# EAGLE design PlacaSchematicbck2 (EAGLE 5.11)
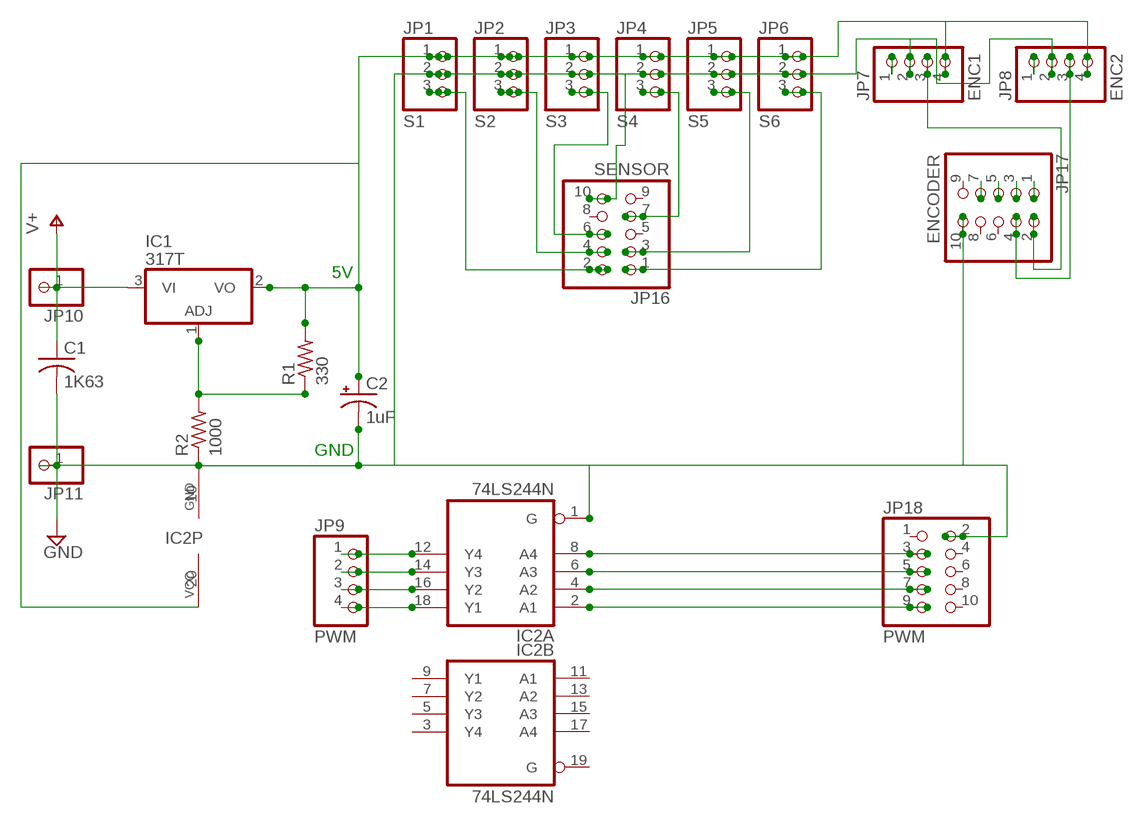
[diagram p0: schematic, sheet 1]

## Parts
C1  1K63  C-US050-025X075  [C050-025X075]
C2  1uF  CPOL-USE2-5  [E2-5]
IC1  317T  [TO220H]
IC2  74LS244N  [DIL20]
JP1  S1  PINHD-1X3  [1X03]
JP2  S2  PINHD-1X3  [1X03]
JP3  S3  PINHD-1X3  [1X03]
JP4  S4  PINHD-1X3  [1X03]
JP5  S5  PINHD-1X3  [1X03]
JP6  S6  PINHD-1X3  [1X03]
JP7  ENC1  PINHD-1X4  [1X04]
JP8  ENC2  PINHD-1X4  [1X04]
JP9  PWM  PINHD-1X4  [1X04]
JP10  PINHD-1X1  [1X01]
JP11  PINHD-1X1  [1X01]
JP16  SENSOR  PINHD-2X5  [2X05]
JP17  ENCODER  PINHD-2X5  [2X05]
JP18  PWM  PINHD-2X5  [2X05]
R1  330  R-US_0207/10  [0207/10]
R2  1000  R-US_0207/10  [0207/10]

## Nets
GND: C1.2 C2.- IC2.1(A:G) IC2.10(P:GND) JP1.2 JP2.2 JP3.2 JP4.2 JP5.2 JP6.2 JP7.2 JP8.2 JP11.1 JP16.10 JP17.10 JP18.2 R2.1
N$1: IC1.1(ADJ) R1.1 R2.2
N$2: C2.+ IC1.2(VO) IC2.20(P:VCC) JP1.1 JP2.1 JP3.1 JP4.1 JP5.1 JP6.1 JP7.4 JP8.4 R1.2
N$3: JP8.3 JP17.4
N$4: IC2.12(A:Y4) JP9.1
N$5: IC2.14(A:Y3) JP9.2
N$6: IC2.16(A:Y2) JP9.3
N$7: IC2.18(A:Y1) JP9.4
N$8: IC2.8(A:A4) JP18.3
N$9: IC2.6(A:A3) JP18.5
N$10: IC2.4(A:A2) JP18.7
N$11: IC2.2(A:A1) JP18.9
N$12: JP8.1
N$13: JP7.3 JP17.2
N$14: JP17.7
N$15: JP1.3 JP16.2
N$16: JP2.3 JP16.4
N$17: JP3.3 JP16.6
N$18: JP4.3 JP16.7
N$19: JP5.3 JP16.3
N$20: JP6.3 JP16.1
N$21: JP7.1
N$22: JP17.5
N$23: JP17.3
N$24: JP17.1
V+: C1.1 IC1.3(VI) JP10.1
Unconnected: IC2.3(B:Y4) IC2.5(B:Y3) IC2.7(B:Y2) IC2.9(B:Y1) IC2.11(B:A1) IC2.13(B:A2) IC2.15(B:A3) IC2.17(B:A4) IC2.19(B:G) JP16.5 JP16.8 JP16.9 JP17.6 JP17.8 JP17.9 JP18.1 JP18.4 JP18.6 JP18.8 JP18.10

## Notes on the sheet
- 5V
- GND

## Library data of the parts
C1 = rcl:C-US: CAPACITOR, American symbol
C2 = rcl:CPOL-US: POLARIZED CAPACITOR, American symbol
IC1 = linear:*317: Positive VOLTAGE REGULATOR
IC2 = 74xx-us:74*244: Octal BUFFER and LINE DRIVER, 3-state
JP1-JP6 = pinhead:PINHD-1X3: PIN HEADER
JP7-JP9 = pinhead:PINHD-1X4: PIN HEADER
JP10 JP11 = pinhead:PINHD-1X1: PIN HEADER
JP16-JP18 = pinhead:PINHD-2X5: PIN HEADER
R1 R2 = resistor:R-US_: RESISTOR, American symbol

## Board
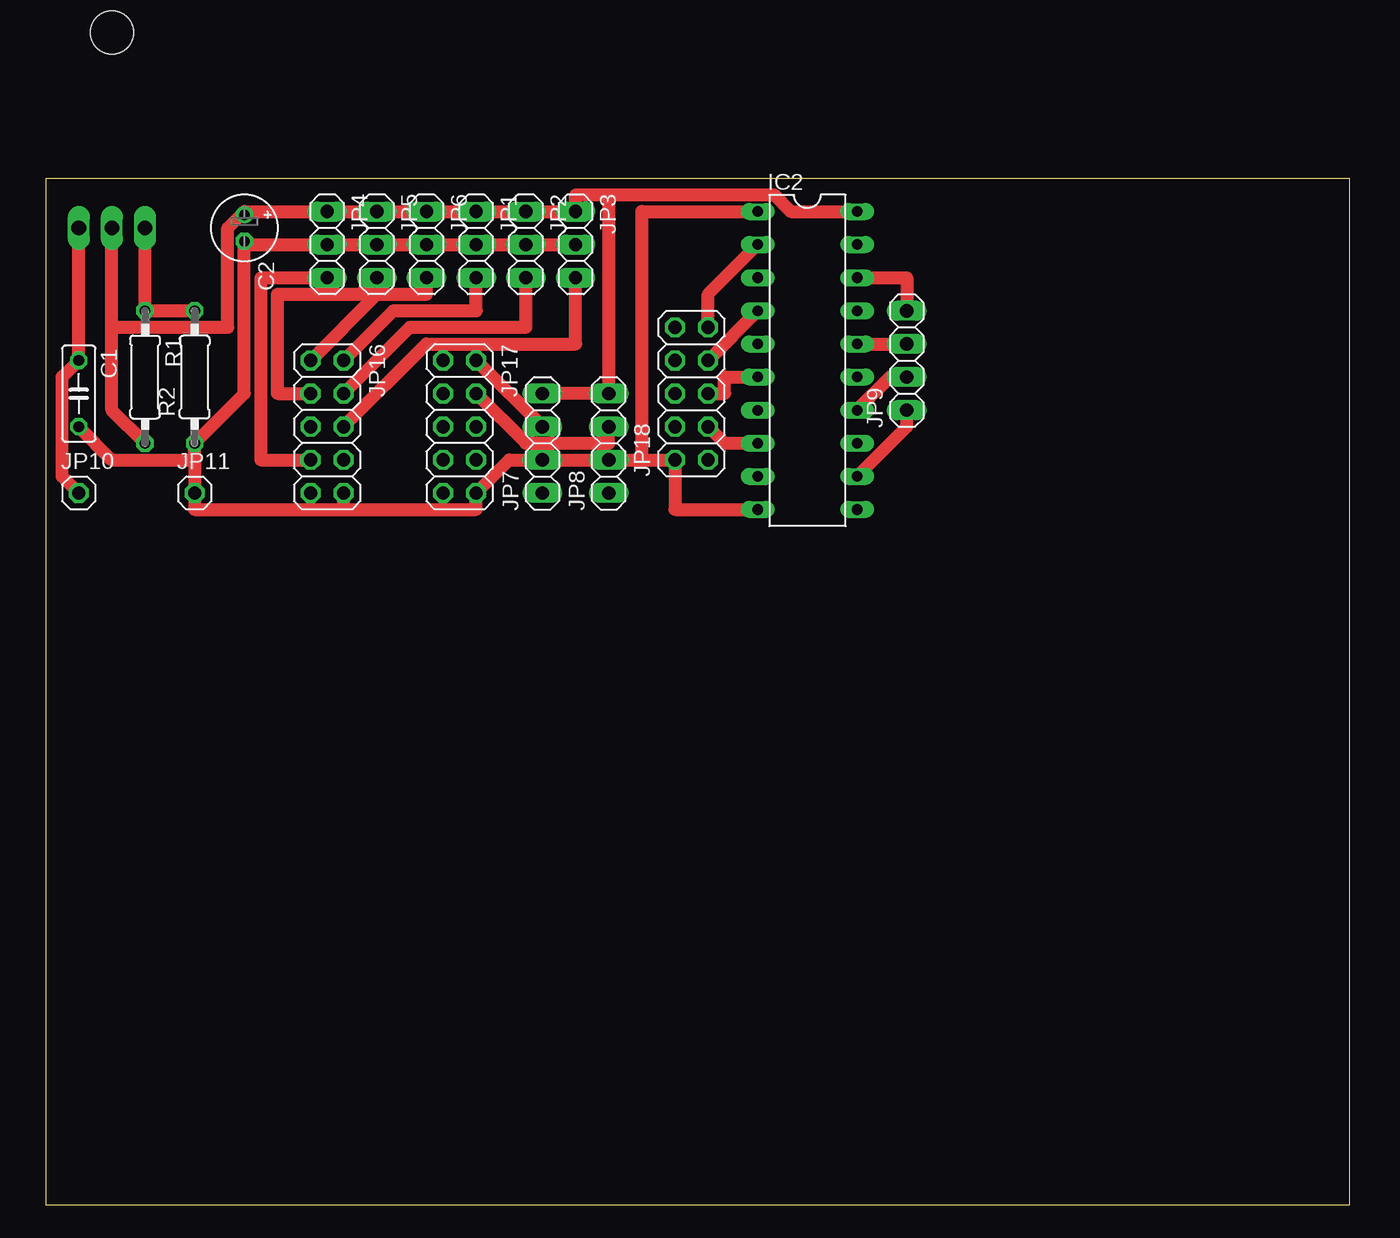
[diagram p1: board, top side]
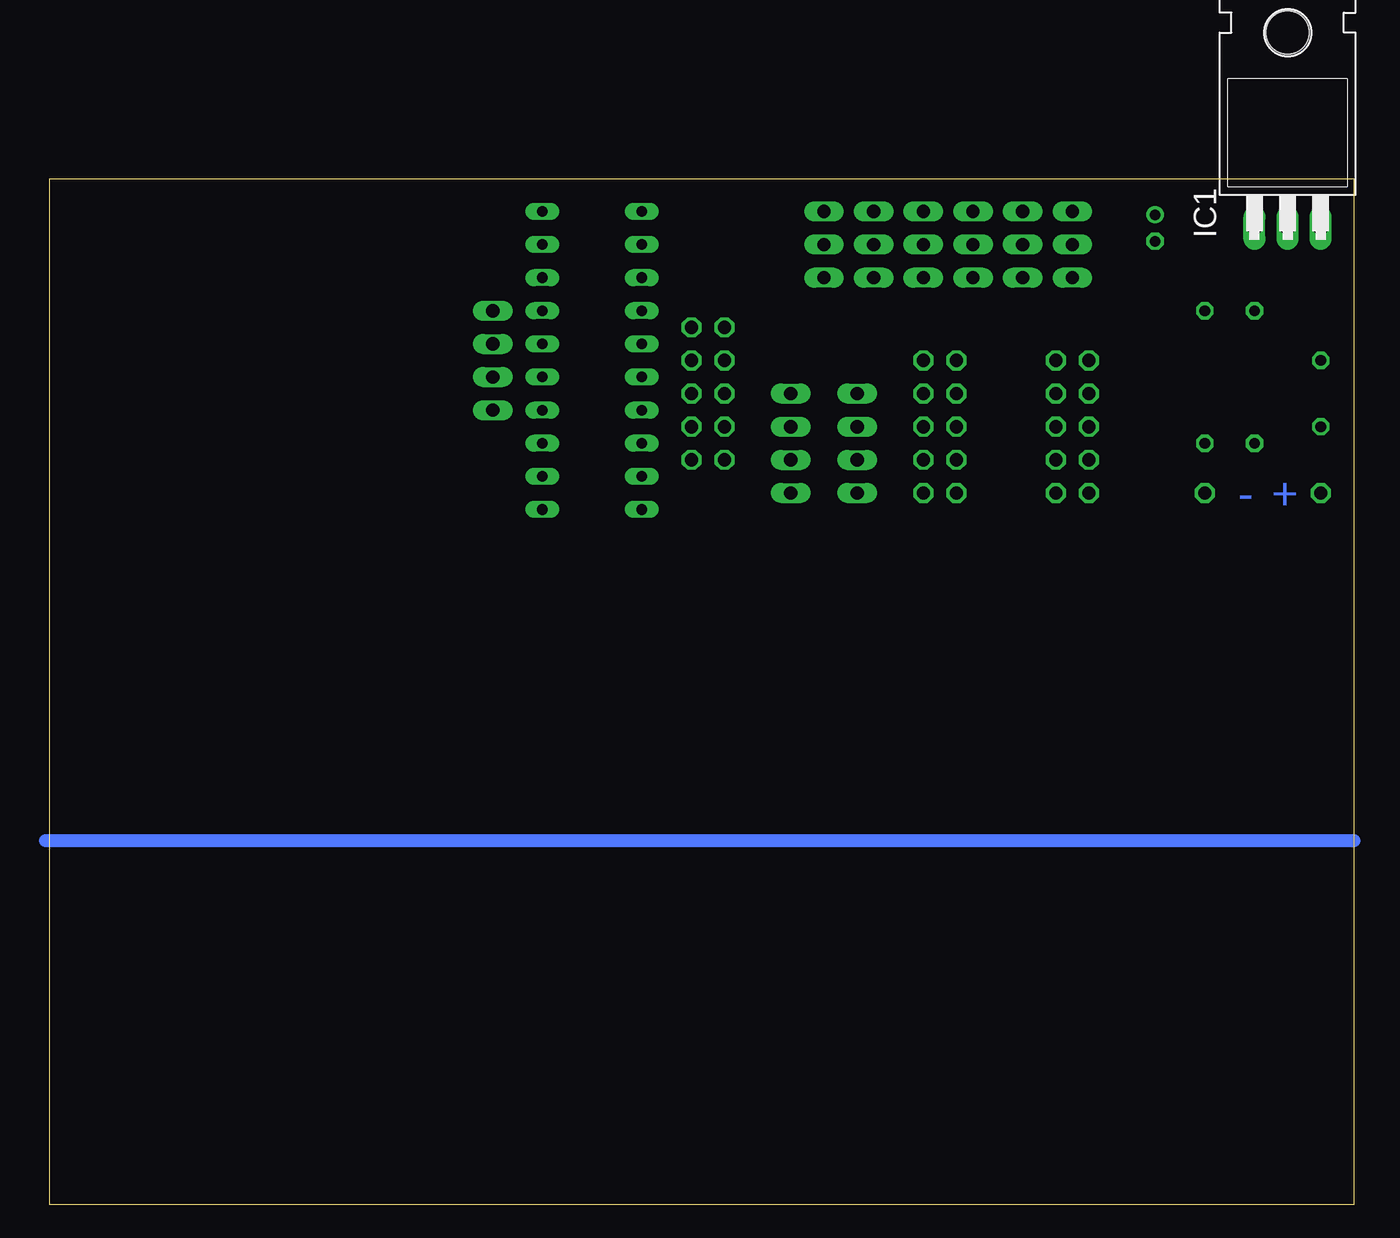
[diagram p2: board, bottom side, seen from below]

Size 100 x 78.73 mm. Coordinates in mm from the lower left corner, seen from the top.
Outline: 0,0 100,0 100,78.73 0,78.73 0,0
Copper layers (1*16): Top 0.035mm / dielectric 1.5mm / Bottom 0.035mm
Design rules "default": minimum track width 10mil, minimum drill 24mil, track to track 8mil, track to pad 8mil, pad to pad 8mil, via to via 8mil, smd to smd 8mil, copper to edge 40mil, drill to drill 8mil, minimum pad ring 10mil, minimum via ring 8mil, stop-mask expansion 4mil, vias tented up to drill 0mil, thermal gap 10mil

### Footprints (pad centres in the part's own frame; a part is rotated, then mirrored left to right if it is on the bottom)
C050-025X075 = drill 0.813 octagon: 1 -2.54,0; 2 2.54,0
E2-5 = drill 0.813 pad 1.27 round: + -1.016,0 | drill 0.813 pad 1.27 octagon: - 1.016,0
TO220H = drill 1.118 long: 1 -2.54,-10.16; 2 0,-10.16; 3 2.54,-10.16 | hole 3.302: 0,4.826
DIL20 = drill 0.813 long: 1 -11.43,-3.81; 2 -8.89,-3.81; 3 -6.35,-3.81; 4 -3.81,-3.81; 5 -1.27,-3.81; 6 1.27,-3.81; 7 3.81,-3.81; 8 6.35,-3.81; 9 8.89,-3.81; 10 11.43,-3.81; 11 11.43,3.81; 12 8.89,3.81; 13 6.35,3.81; 14 3.81,3.81; 15 1.27,3.81; 16 -1.27,3.81; 17 -3.81,3.81; 18 -6.35,3.81; 19 -8.89,3.81; 20 -11.43,3.81
1X03 = drill 1.016 long: 1 -2.54,0; 2 0,0; 3 2.54,0
1X04 = drill 1.016 long: 1 -3.81,0; 2 -1.27,0; 3 1.27,0; 4 3.81,0
1X01 = drill 1.016 octagon: 1 0,0
2X05 = drill 1.016 octagon: 1 -5.08,-1.27; 2 -5.08,1.27; 3 -2.54,-1.27; 4 -2.54,1.27; 5 0,-1.27; 6 0,1.27; 7 2.54,-1.27; 8 2.54,1.27; 9 5.08,-1.27; 10 5.08,1.27
0207/10 = drill 0.813 octagon: 1 -5.08,0; 2 5.08,0

### Placement (x,y rotation side)
C1  2.54,62.23 270 top
C2  15.24,74.93 270 top
IC1  5.08,85.09 0 bottom
IC2  58.42,64.77 270 top
JP1  33.02,73.66 270 top
JP2  36.83,73.66 270 top
JP3  40.64,73.66 270 top
JP4  21.59,73.66 270 top
JP5  25.4,73.66 270 top
JP6  29.21,73.66 270 top
JP7  38.1,58.42 90 top
JP8  43.18,58.42 90 top
JP9  66.04,64.77 90 top
JP10  2.54,54.61 0 top
JP11  11.43,54.61 0 top
JP16  21.59,59.69 270 top
JP17  31.75,59.69 270 top
JP18  49.53,62.23 90 top
R1  7.62,63.5 270 top
R2  11.43,63.5 90 top

### Tracks (layer width: path | path; a pad name or v marks a point on that pad's centre or on a via)
GND
  Top 1: 45.72,57.15 JP18.2 48.26,53.34 IC2.10 | 45.72,57.15 JP8.2 JP7.2 35.56,57.15 JP17.10 33.02,53.34 22.86,53.34 | IC2.1 45.72,76.2 45.72,57.15 | 11.43,57.15 JP11.1 11.43,53.34 22.86,53.34 | 11.43,57.15 R2.1 15.24,62.23 15.24,73.66 | C1.2 5.08,57.15 11.43,57.15 | 15.24,73.66 JP4.2 JP5.2 JP6.2 JP1.2 JP2.2 JP3.2 | 15.24,73.66 C2.- | 22.86,53.34 JP16.10
N$1
  Top 1: R2.2 R1.1 IC1.1
N$2
  Top 1: JP7.4 JP8.4 43.18,77.47 | IC2.20 57.15,76.2 55.88,77.47 43.18,77.47 | 43.18,77.47 40.64,77.47 JP3.1 JP2.1 JP1.1 JP6.1 JP5.1 JP4.1 15.24,76.2 | R1.2 5.08,60.96 5.08,67.31 | 5.08,67.31 IC1.2 | 5.08,67.31 13.97,67.31 13.97,74.93 15.24,76.2 | 15.24,76.2 C2.+
N$3
  Top 1: JP17.4 36.83,58.42 43.18,58.42 JP8.3
N$4
  Top 1: IC2.12 66.04,59.69 JP9.1
N$5
  Top 1: IC2.14 64.77,63.5 JP9.2
N$6
  Top 1: IC2.16 JP9.3
N$7
  Top 1: IC2.18 66.04,71.12 JP9.4
N$8
  Top 1: IC2.8 52.07,58.42 JP18.3
N$9
  Top 1: IC2.6 52.07,63.5 52.07,62.23 JP18.5
N$10
  Top 1: JP18.7 IC2.4
N$11
  Top 1: IC2.2 50.8,69.85 JP18.9
N$13
  Top 1: JP17.2 JP7.3
N$15
  Top 1: JP16.2 26.67,68.58 33.02,68.58 JP1.3
N$16
  Top 1: JP16.4 27.94,67.31 36.83,67.31 JP2.3
N$17
  Top 1: JP16.6 29.21,66.04 40.64,66.04 JP3.3
N$18
  Top 1: JP16.7 16.51,57.15 16.51,71.12 JP4.3
N$19
  Top 1: JP16.3 17.78,62.23 17.78,69.85 24.13,69.85 JP5.3
N$20
  Top 1: JP16.1 25.4,69.85 29.21,69.85 JP6.3
N$25
  Bottom 1: 0,27.94 100.33,27.94
V+
  Top 1: IC1.3 C1.1 1.27,63.5 1.27,55.88 JP10.1

### Text on the board
Bottom: + | -